# Altium schematic sheet POWER_AUX.SchDoc
size A3; SheetNumber: 4; SheetTotal: 23
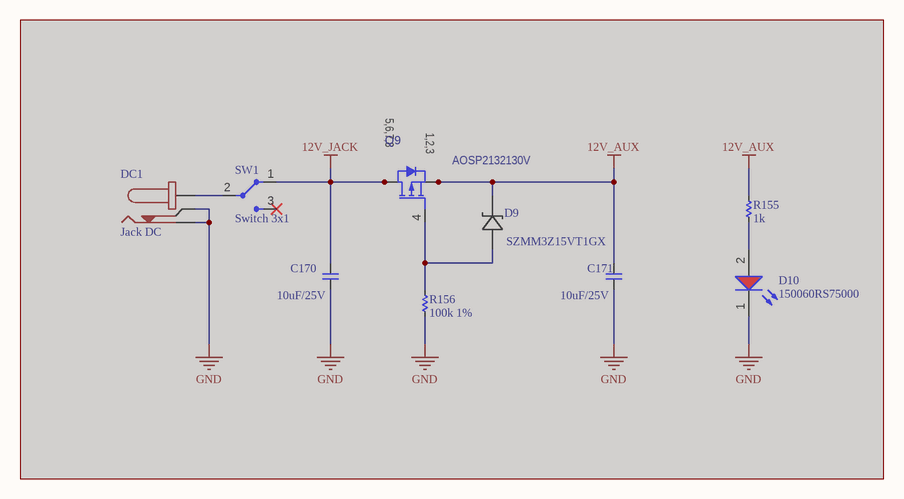
[diagram p0: POWER_AUX.SchDoc]

## Parts
C170  10uF/25V  [CAP_C_1005X60]  (masked out: inside a compile mask, not in the netlist)
C171  10uF/25V  [CAP_C_1005X60]  (masked out: inside a compile mask, not in the netlist)
D9  SZMM3Z15VT1GX  [ZDO_SOD223-SC-76_NEX]  (masked out: inside a compile mask, not in the netlist)
D10  150060RS75000  [LED_0603]  (masked out: inside a compile mask, not in the netlist)
DC1  Jack DC  [DC0]  (masked out: inside a compile mask, not in the netlist)
Q9  value AOSP2132130V  [SO8SOP-8L_AOS]  (hidden comment: Transistor MOS-P SSSGDDDD)  (masked out: inside a compile mask, not in the netlist)
R155  1k  [RES_C_1005x30_L]  (masked out: inside a compile mask, not in the netlist)
R156  100k 1%  [RES_C_1005x30_L]  (masked out: inside a compile mask, not in the netlist)
SW1  Switch 3x1  [SS12D10]  (masked out: inside a compile mask, not in the netlist)

## Notes on the sheet
- Project:
- Page Contents:
- Revision:
- Design:
- Date:
- Size:
- A3
- Document Number:
- Sheet:
- of
- (in symbol AOSP2132130V) 5,6,7,8; 1,2,3

## Library data of the parts
C170 C171 = _CAP_C_2: CAP CHIP
D9 = SZMM3Z15VT1GX: DIODE ZENER 15V 300MW SOD323; Manufacturer_Name: Nexperia; Manufacturer_Part_Number: SZMM3Z18VT1GX; Copyright: Copyright (C) 2026 Ultra Librarian. All rights reserved.
D10 = _LED_RED: LED RED CLEAR 0603 SMD
DC1 = DCIN: Jack DC input; Value: Jac DC
Q9 = AOSP2132130V: MOSFET P-CH 30V 11A 8SOIC; Manufacturer 1: Alpha & Omega Semiconductor Inc.; MCHP-ID: TRA1639; Description_: TRANS FET P-CH AOSP2132130V 11A 3.1W SOIC-8; Dev Tools Status: Design; Type: FET; Gate to Source Voltage: 25V; Power: 3.1W; Populated: YES; Owner: Dragos Danaila; Revision: 1; Symbol: Transistor MOS-P SSSGDDDD; Status: MCL Design; Package: SOIC 8; ComponentLink1URL: https://chn-vm-apps.microchip.com/mchprepo/parts/Datasheets/AOSP21321.pdf; ComponentLink1Description: SVN Datasheet; ComponentLink2URL: C:\ALTIUM_WORK\00001_MCHP-CDB\Datasheets\AOSP21321.pdf; ComponentLink2Description: Local Datasheet; ComponentLink3URL: C:\ALTIUM_WORK\00001_MCHP-CDB\Library\LibraryRefs\Transistor MOS-P SSSGDDDD.SchLib; ComponentLink3Description: Open Symbol; ComponentLink4URL: C:\ALTIUM_WORK\00001_MCHP-CDB\Library\Footprints\SOIC-8.PcbLib; ComponentLink4Description: Open Footprint; ComponentLink5Description: Open Footprint 2; ComponentLink6Description: Open Footprint 3; ComponentLink7Description: Open Footprint 4; Operating Temperature: -55C to +150C; Category: Transistor; Current: 11A; Drain to Source Voltage: 30V; Manufacturer Part Number 1: AOSP21321; Supplier 1: Digi-Key; Supplier Part Number 1: 785-1795-2-ND; Quantity Override: 1
R155 R156 = _RES_B_2: RES
SW1 = SW3x1: Value: Switch 4x2